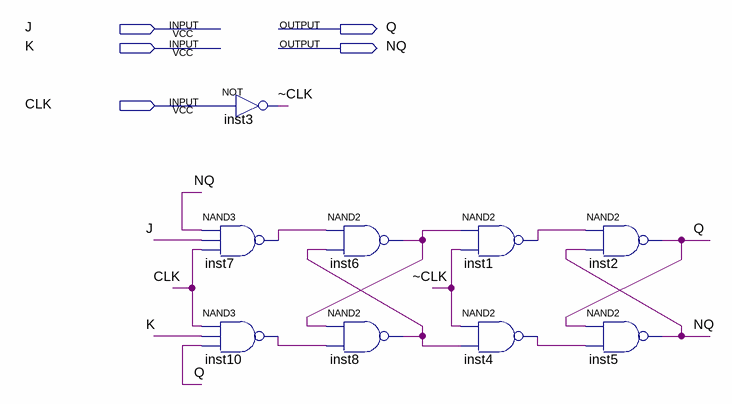
[diagram p0: schematic sheet]
// Quartus schematic FlipFlopJK.bdf as structural Verilog: 9 symbols, 5 pins
module FlipFlopJK (
  input  J,
  input  K,
  input  CLK,
  output Q,
  output NQ
);

  wire inst1_out, inst4_out, inst6_out, inst7_out, inst8_out, inst10_out, \~CLK ;

  not inst3 (\~CLK , CLK);
  nand inst7 (inst7_out, NQ, J, CLK);
  nand inst10 (inst10_out, CLK, K, Q);
  nand inst6 (inst6_out, inst7_out, inst8_out);
  nand inst8 (inst8_out, inst6_out, inst10_out);
  nand inst1 (inst1_out, inst6_out, \~CLK );
  nand inst4 (inst4_out, \~CLK , inst8_out);
  nand inst2 (Q, inst1_out, NQ);
  nand inst5 (NQ, Q, inst4_out);
endmodule
